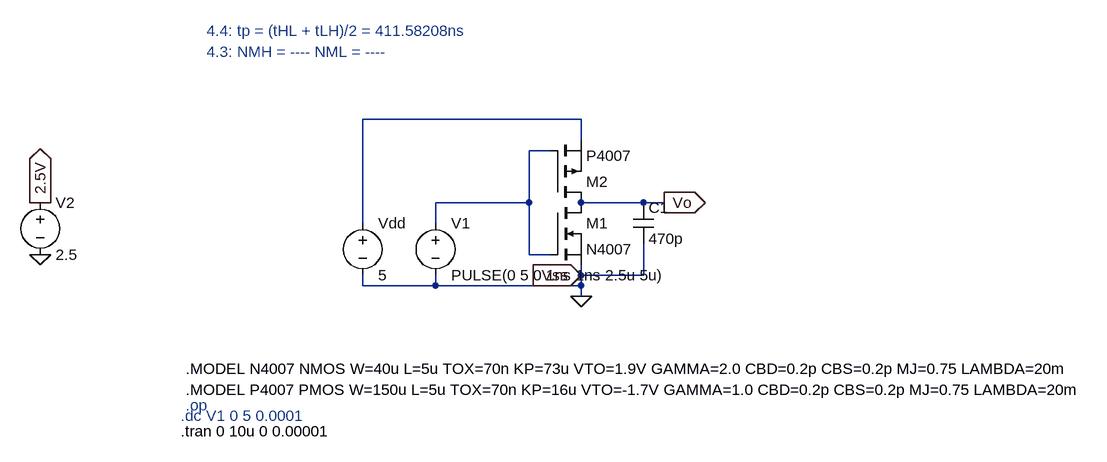
[diagram p0: schematic Inversor_CMOS.asc]
Inversor_CMOS.asc, the LTspice schematic file:
Version 4
SHEET 1 980 680
WIRE 128 112 -208 112
WIRE 128 144 128 112
WIRE 80 160 48 160
WIRE 48 240 48 160
WIRE 48 240 -96 240
WIRE 224 240 128 240
WIRE 256 240 224 240
WIRE -208 272 -208 112
WIRE -96 272 -96 240
WIRE 48 320 48 240
WIRE 80 320 48 320
WIRE 128 352 128 336
WIRE 224 352 224 304
WIRE 224 352 128 352
WIRE -208 368 -208 352
WIRE -96 368 -96 352
WIRE -96 368 -208 368
WIRE 128 368 128 352
WIRE 128 368 -96 368
WIRE 128 384 128 368
FLAG 128 384 0
FLAG 128 352 Vss
IOPIN 128 352 In
FLAG 256 240 Vo
IOPIN 256 240 Out
FLAG -704 240 2.5V
IOPIN -704 240 Out
FLAG -704 320 0
SYMBOL nmos 80 240 R0
SYMATTR InstName M1
SYMATTR Value N4007
SYMBOL pmos 80 240 M180
SYMATTR InstName M2
SYMATTR Value P4007
SYMBOL voltage -96 256 R0
WINDOW 123 0 0 Left 0
WINDOW 39 0 0 Left 0
SYMATTR InstName V1
SYMATTR Value PULSE(0 5 0 1ns 1ns 2.5u 5u)
SYMBOL voltage -208 256 R0
WINDOW 123 0 0 Left 0
WINDOW 39 0 0 Left 0
SYMATTR InstName Vdd
SYMATTR Value 5
SYMBOL cap 208 240 R0
SYMATTR InstName C1
SYMATTR Value 470p
SYMBOL voltage -704 224 R0
WINDOW 123 0 0 Left 0
WINDOW 39 0 0 Left 0
SYMATTR InstName V2
SYMATTR Value 2.5
TEXT -480 496 Left 2 !.MODEL N4007 NMOS W=40u L=5u TOX=70n KP=73u VTO=1.9V GAMMA=2.0 CBD=0.2p CBS=0.2p MJ=0.75 LAMBDA=20m
TEXT -480 528 Left 2 !.MODEL P4007 PMOS W=150u L=5u TOX=70n KP=16u VTO=-1.7V GAMMA=1.0 CBD=0.2p CBS=0.2p MJ=0.75 LAMBDA=20m
TEXT -480 552 Left 2 ;.op
TEXT -488 568 Left 2 ;.dc V1 0 5 0.0001
TEXT -488 592 Left 2 !.tran 0 10u 0 0.00001
TEXT -448 -24 Left 2 ;4.4: tp = (tHL + tLH)/2 = 411.58208ns
TEXT -448 8 Left 2 ;4.3: NMH = ---- NML = ----

The netlist it stands for:
* Inversor_CMOS.asc
M1 Vo N002 0 0 N4007
M2 Vo N002 N001 N001 P4007
V1 N002 0 PULSE(0 5 0 1ns 1ns 2.5u 5u)
Vdd N001 0 5
C1 Vo 0 470p
V2 2.5V 0 2.5
.model NMOS NMOS
.model PMOS PMOS
.lib standard.mos
.MODEL N4007 NMOS W=40u L=5u TOX=70n KP=73u VTO=1.9V GAMMA=2.0 CBD=0.2p CBS=0.2p MJ=0.75 LAMBDA=20m
.MODEL P4007 PMOS W=150u L=5u TOX=70n KP=16u VTO=-1.7V GAMMA=1.0 CBD=0.2p CBS=0.2p MJ=0.75 LAMBDA=20m
* .op
* .dc V1 0 5 0.0001
.tran 0 10u 0 0.00001
* 4.4: tp = (tHL + tLH)/2 = 411.58208ns
* 4.3: NMH = ---- NML = ----
.backanno
.end